# EasyEDA schematic SCH.json
TITLE: Sheet_1; REV: 1.0; Date: 2025-06-17; Sheet: 1/1; Drawn By: mahammad.heshmat.abdel.raheem; Company: Your Company
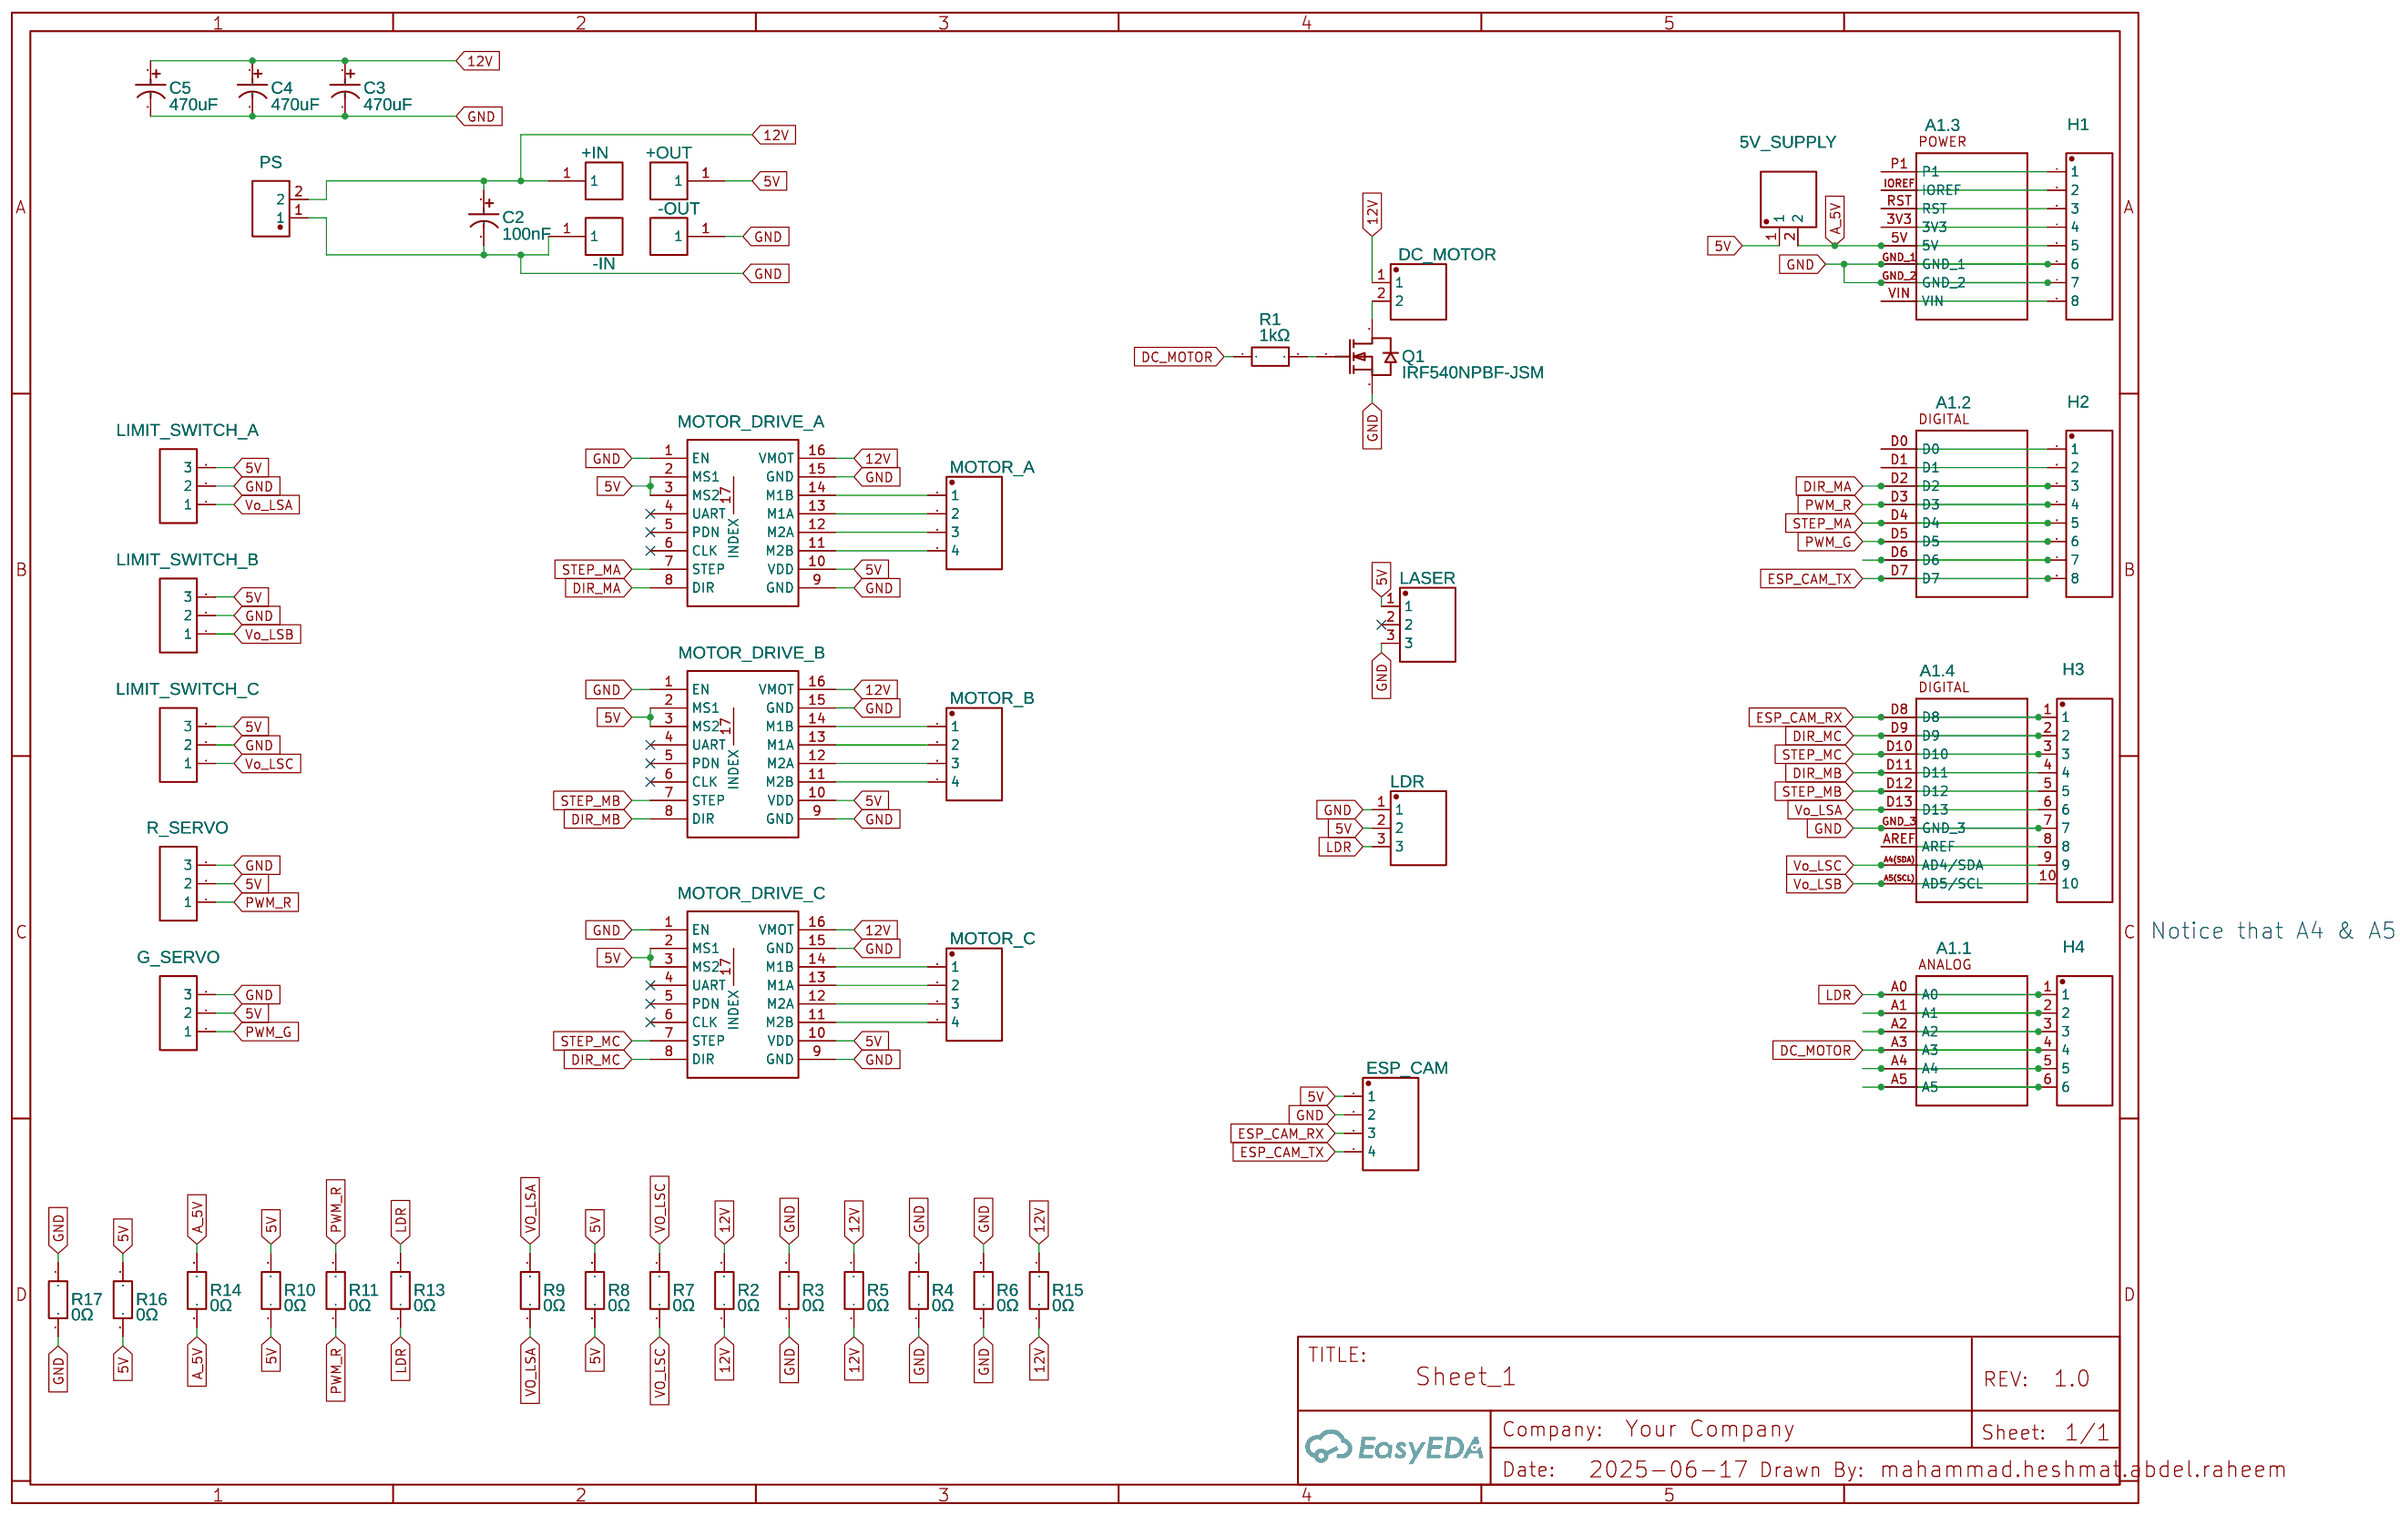
[diagram p0: schematic sheet]

## Parts
5V_SUPPLY  210S-1*2P L=11.6MMGold-plated black  [HDR-TH_2P-P2.54-V-M-1]
+IN  PZ254V-11-01P  [HDR-TH_1P-P2.54-V-M]
+OUT  PZ254V-11-01P  [HDR-TH_1P-P2.54-V-M]
-IN  PZ254V-11-01P  [HDR-TH_1P-P2.54-V-M]
-OUT  PZ254V-11-01P  [HDR-TH_1P-P2.54-V-M]
A1  A000066  [ARDUINO_A000066]  (sections 1,2,3,4)
C2  100nF  [CAP-TH_BD5.0-P2.00-D0.8-FD]
C3  470uF  [CAP-TH_BD10.0-P5.00-D0.6-FD]
C4  470uF  [CAP-TH_BD10.0-P5.00-D0.6-FD]
C5  470uF  [CAP-TH_BD10.0-P5.00-D0.6-FD]
DC_MOTOR  210S-1*2P L=11.6MMGold-plated black  [HDR-TH_2P-P2.54-V-M-1]
ESP_CAM  Header-Male-2.54_1x4  [HDR-TH_4P-P2.54-V-M]
G_SERVO  Header-Male-2.54_1x3  [HDR-TH_3P-P2.54-V-M-1]
H1  Header-Male-2.54_1x8  [HDR-TH_8P-P2.54-V-M]
H2  Header-Male-2.54_1x8  [HDR-TH_8P-P2.54-V-M]
H3  210S-1*10P L=11.6MMGold-plated black  [HDR-TH_10P-P2.54-V-M-1]
H4  210S-1*6P L=11.6MMGold-plated black  [HDR-TH_6P-P2.54-V_Z-211-0611-0021-001]
LASER  210S-1*3P L=11.6MMGold-plated black  [HDR-TH_3P-P2.54-V-M-1]
LDR  210S-1*3P L=11.6MMGold-plated black  [HDR-TH_3P-P2.54-V-M-1]
LIMIT_SWITCH_A  Header-Male-2.54_1x3  [HDR-TH_3P-P2.54-V-M-1]
LIMIT_SWITCH_B  Header-Male-2.54_1x3  [HDR-TH_3P-P2.54-V-M-1]
LIMIT_SWITCH_C  Header-Male-2.54_1x3  [HDR-TH_3P-P2.54-V-M-1]
MOTOR_A  Header-Male-2.54_1x4  [HDR-TH_4P-P2.54-V-M]
MOTOR_B  Header-Male-2.54_1x4  [HDR-TH_4P-P2.54-V-M]
MOTOR_C  Header-Male-2.54_1x4  [HDR-TH_4P-P2.54-V-M]
MOTOR_DRIVE_A  TMC2208  [TMC2208]
MOTOR_DRIVE_B  TMC2208  [TMC2208]
MOTOR_DRIVE_C  TMC2208  [TMC2208]
PS  KF2EDGR-5.08-2P  [CONN-TH_2P-P5.08_KF2EDGR-5.08-2P]
Q1  IRF540NPBF-JSM  [TO-220-3_L10.0-W4.5-P2.54-L]
R1  1kΩ  [RES-TH_BD2.4-L6.3-P10.30-D0.6]
R2  0Ω  [RES-TH_BD2.4-L6.3-P10.30-D0.6]
R3  0Ω  [RES-TH_BD2.4-L6.3-P10.30-D0.6]
R4  0Ω  [RES-TH_BD2.4-L6.3-P10.30-D0.6]
R5  0Ω  [RES-TH_BD2.4-L6.3-P10.30-D0.6]
R6  0Ω  [RES-TH_BD2.4-L6.3-P10.30-D0.6]
R7  0Ω  [RES-TH_BD2.4-L6.3-P10.30-D0.6]
R8  0Ω  [RES-TH_BD2.4-L6.3-P10.30-D0.6]
R9  0Ω  [RES-TH_BD2.4-L6.3-P10.30-D0.6]
R10  0Ω  [RES-TH_BD2.4-L6.3-P10.30-D0.6]
R11  0Ω  [RES-TH_BD2.4-L6.3-P10.30-D0.6]
R13  0Ω  [RES-TH_BD2.4-L6.3-P10.30-D0.6]
R14  0Ω  [RES-TH_BD2.4-L6.3-P10.30-D0.6]
R15  0Ω  [RES-TH_BD2.4-L6.3-P10.30-D0.6]
R16  0Ω  [RES-TH_BD2.4-L6.3-P10.30-D0.6]
R17  0Ω  [RES-TH_BD2.4-L6.3-P10.30-D0.6]
R_SERVO  Header-Male-2.54_1x3  [HDR-TH_3P-P2.54-V-M-1]

## Library data of the parts
5V_SUPPLY DC_MOTOR = 210S-1*2P L=11.6MMGold-plated black: Contributor: LCSC; Supplier: LCSC; Manufacturer: Ckmtw(灿科盟); Manufacturer Part: B-2100S02P-A110; Supplier Part: C124375; JLCPCB Part Class: Extended Part
+IN +OUT -IN -OUT = PZ254V-11-01P: Contributor: LCSC; Supplier: LCSC; Supplier Part: C492400; Manufacturer: XFCN(兴飞); JLCPCB Part Class: Extended Part
A1 = A000066: Contributor: narwhal14; subpart_no: 1
C2 = 0.1UF 50V: Supplier: LCSC; Manufacturer: CX(承兴); Manufacturer Part: KM104M050D11RR0VH2FP0; Supplier Part: C28061; JLCPCB Part Class: Extended Part
C3-C5 = EKY-250ELL471MJC5S: Supplier: LCSC; Manufacturer: NCC(日本贵弥功); Supplier Part: C133442; JLCPCB Part Class: Extended Part
ESP_CAM MOTOR_A MOTOR_B MOTOR_C = Header-Male-2.54_1x4: Contributor: LCSC; Supplier: LCSC; Manufacturer: Ckmtw(灿科盟); Manufacturer Part: B-2100S04P-A110; Supplier Part: C124378; JLCPCB Part Class: Extended Part
G_SERVO LIMIT_SWITCH_A LIMIT_SWITCH_B LIMIT_SWITCH_C R_SERVO = Header-Male-2.54_1x3: Supplier: LCSC; Manufacturer: BOOMELE(博穆精密); Manufacturer Part: 2.54-1*3P针; Supplier Part: C49257; JLCPCB Part Class: Extended Part
H1 H2 = Header-Male-2.54_1x8: Contributor: LCSC; Supplier: LCSC; Manufacturer: Ckmtw(灿科盟); Manufacturer Part: B-2100S08P-A110; Supplier Part: C124381; JLCPCB Part Class: Extended Part
H3 = 210S-1*10P L=11.6MMGold-plated black: Contributor: LCSC; Supplier: LCSC; Manufacturer: Ckmtw(灿科盟); Manufacturer Part: B-2100S10P-A110; Supplier Part: C124372; JLCPCB Part Class: Extended Part
H4 = 210S-1*6P L=11.6MMGold-plated black: Contributor: LCSC; Supplier: LCSC; Manufacturer: Ckmtw(灿科盟); Manufacturer Part: B-2100S06P-A110; Supplier Part: C124380; JLCPCB Part Class: Extended Part
LASER LDR = 210S-1*3P L=11.6MMGold-plated black: Contributor: LCSC; Supplier: LCSC; Manufacturer: Ckmtw(灿科盟); Manufacturer Part: B-2100S03P-A110; Supplier Part: C124376; JLCPCB Part Class: Extended Part
MOTOR_DRIVE_A MOTOR_DRIVE_B MOTOR_DRIVE_C = TMC2208: Contributor: overprint official korea
PS = KF2EDGR-5.08-2P: Contributor: LCSC; Supplier: LCSC; Supplier Part: C441204; Manufacturer: KEFA(科发); JLCPCB Part Class: Extended Part
Q1 = IRF540NPBF-JSM: Supplier: LCSC; Supplier Part: C18187910; Manufacturer: JSMSEMI(杰盛微); JLCPCB Part Class: Extended Part; Contributor: lcsc
R1-R11 R13-R17 = RN 1/4W 1K F T/B A1: Contributor: LCSC; Supplier: LCSC; Supplier Part: C410696; Manufacturer: Tyohm(幸亚电阻); JLCPCB Part Class: Extended Part

## Nets
5V: 5V_SUPPLY.1 +OUT.1 ESP_CAM.1 G_SERVO.2 LASER.1 LDR.2 LIMIT_SWITCH_A.3 LIMIT_SWITCH_B.3 LIMIT_SWITCH_C.3 MOTOR_DRIVE_A.2(MS1) MOTOR_DRIVE_A.3(MS2) MOTOR_DRIVE_A.10(VDD) MOTOR_DRIVE_B.2(MS1) MOTOR_DRIVE_B.3(MS2) MOTOR_DRIVE_B.10(VDD) MOTOR_DRIVE_C.2(MS1) MOTOR_DRIVE_C.3(MS2) MOTOR_DRIVE_C.10(VDD) R8.1 R8.2 R10.1 R10.2 R16.1 R16.2 R_SERVO.2
12V: +IN.1 C2.1 C3.1 C4.1 C5.1 DC_MOTOR.1 MOTOR_DRIVE_A.16(VMOT) MOTOR_DRIVE_B.16(VMOT) MOTOR_DRIVE_C.16(VMOT) PS.2 R2.1 R2.2 R5.1 R5.2 R15.1 R15.2
GND: -IN.1 -OUT.1 A1.GND_1 A1.GND_2 A1.GND_3 C2.2 C3.2 C4.2 C5.2 ESP_CAM.2 G_SERVO.3 H1.6 H1.7 H3.7 LASER.3 LDR.1 LIMIT_SWITCH_A.2 LIMIT_SWITCH_B.2 LIMIT_SWITCH_C.2 MOTOR_DRIVE_A.1(EN) MOTOR_DRIVE_A.9(GND) MOTOR_DRIVE_A.15(GND) MOTOR_DRIVE_B.1(EN) MOTOR_DRIVE_B.9(GND) MOTOR_DRIVE_B.15(GND) MOTOR_DRIVE_C.1(EN) MOTOR_DRIVE_C.9(GND) MOTOR_DRIVE_C.15(GND) PS.1 Q1.3(S) R3.1 R3.2 R4.1 R4.2 R6.1 R6.2 R17.1 R17.2 R_SERVO.3
A_5V: 5V_SUPPLY.2 A1.5V H1.5 R14.1 R14.2
DC_MOTOR: A1.A3 H4.4 R1.1
DIR_MA: A1.D2 H2.3 MOTOR_DRIVE_A.8(DIR)
DIR_MB: A1.D11 H3.4 MOTOR_DRIVE_B.8(DIR)
DIR_MC: A1.D9 H3.2 MOTOR_DRIVE_C.8(DIR)
ESP_CAM_RX: A1.D8 ESP_CAM.3 H3.1
ESP_CAM_TX: A1.D7 ESP_CAM.4 H2.8
LDR: A1.A0 H4.1 LDR.3 R13.1 R13.2
PWM_G: A1.D5 G_SERVO.1 H2.6
PWM_R: A1.D3 H2.4 R11.1 R11.2 R_SERVO.1
STEP_MA: A1.D4 H2.5 MOTOR_DRIVE_A.7(STEP)
STEP_MB: A1.D12 H3.5 MOTOR_DRIVE_B.7(STEP)
STEP_MC: A1.D10 H3.3 MOTOR_DRIVE_C.7(STEP)
Vo_LSA: A1.D13 H3.6 LIMIT_SWITCH_A.1
VO_LSA: R9.1 R9.2
Vo_LSB: A1.A5(SCL)(AD5/SCL) H3.10 LIMIT_SWITCH_B.1
Vo_LSC: A1.A4(SDA)(AD4/SDA) H3.9 LIMIT_SWITCH_C.1
VO_LSC: R7.1 R7.2
Net-(A1.1-A1): A1.A1 H4.2
Net-(A1.1-A2): A1.A2 H4.3
Net-(A1.1-A4): A1.A4 H4.5
Net-(A1.1-A5): A1.A5 H4.6
Net-(A1.2-D0): A1.D0 H2.1
Net-(A1.2-D1): A1.D1 H2.2
Net-(A1.2-D6): A1.D6 H2.7
Net-(A1.3-3V3): A1.3V3 H1.4
Net-(A1.3-IOREF): A1.IOREF H1.2
Net-(A1.3-P1): A1.P1 H1.1
Net-(A1.3-RST): A1.RST H1.3
Net-(A1.3-VIN): A1.VIN H1.8
Net-(A1.4-AREF): A1.AREF H3.8
Net-(DC_MOTOR-2): DC_MOTOR.2 Q1.2(D)
Net-(MOTOR_A-1): MOTOR_A.1 MOTOR_DRIVE_A.14(M1B)
Net-(MOTOR_A-2): MOTOR_A.2 MOTOR_DRIVE_A.13(M1A)
Net-(MOTOR_A-3): MOTOR_A.3 MOTOR_DRIVE_A.12(M2A)
Net-(MOTOR_A-4): MOTOR_A.4 MOTOR_DRIVE_A.11(M2B)
Net-(MOTOR_B-1): MOTOR_B.1 MOTOR_DRIVE_B.14(M1B)
Net-(MOTOR_B-2): MOTOR_B.2 MOTOR_DRIVE_B.13(M1A)
Net-(MOTOR_B-3): MOTOR_B.3 MOTOR_DRIVE_B.12(M2A)
Net-(MOTOR_B-4): MOTOR_B.4 MOTOR_DRIVE_B.11(M2B)
Net-(MOTOR_C-1): MOTOR_C.1 MOTOR_DRIVE_C.14(M1B)
Net-(MOTOR_C-2): MOTOR_C.2 MOTOR_DRIVE_C.13(M1A)
Net-(MOTOR_C-3): MOTOR_C.3 MOTOR_DRIVE_C.12(M2A)
Net-(MOTOR_C-4): MOTOR_C.4 MOTOR_DRIVE_C.11(M2B)
Net-(Q1-1): Q1.1(G) R1.2

Not connected (* = marked no-connect by the designer): LASER 2*; MOTOR_DRIVE_A 4(UART)* 5(PDN)* 6(CLK)* 17(INDEX); MOTOR_DRIVE_B 4(UART)* 5(PDN)* 6(CLK)* 17(INDEX); MOTOR_DRIVE_C 4(UART)* 5(PDN)* 6(CLK)* 17(INDEX)

## Notes on the sheet
- Notice that A4 & A5 are connected to both rows!!
